# EAGLE design Pedal System Circuit (EAGLE 8.4.1)
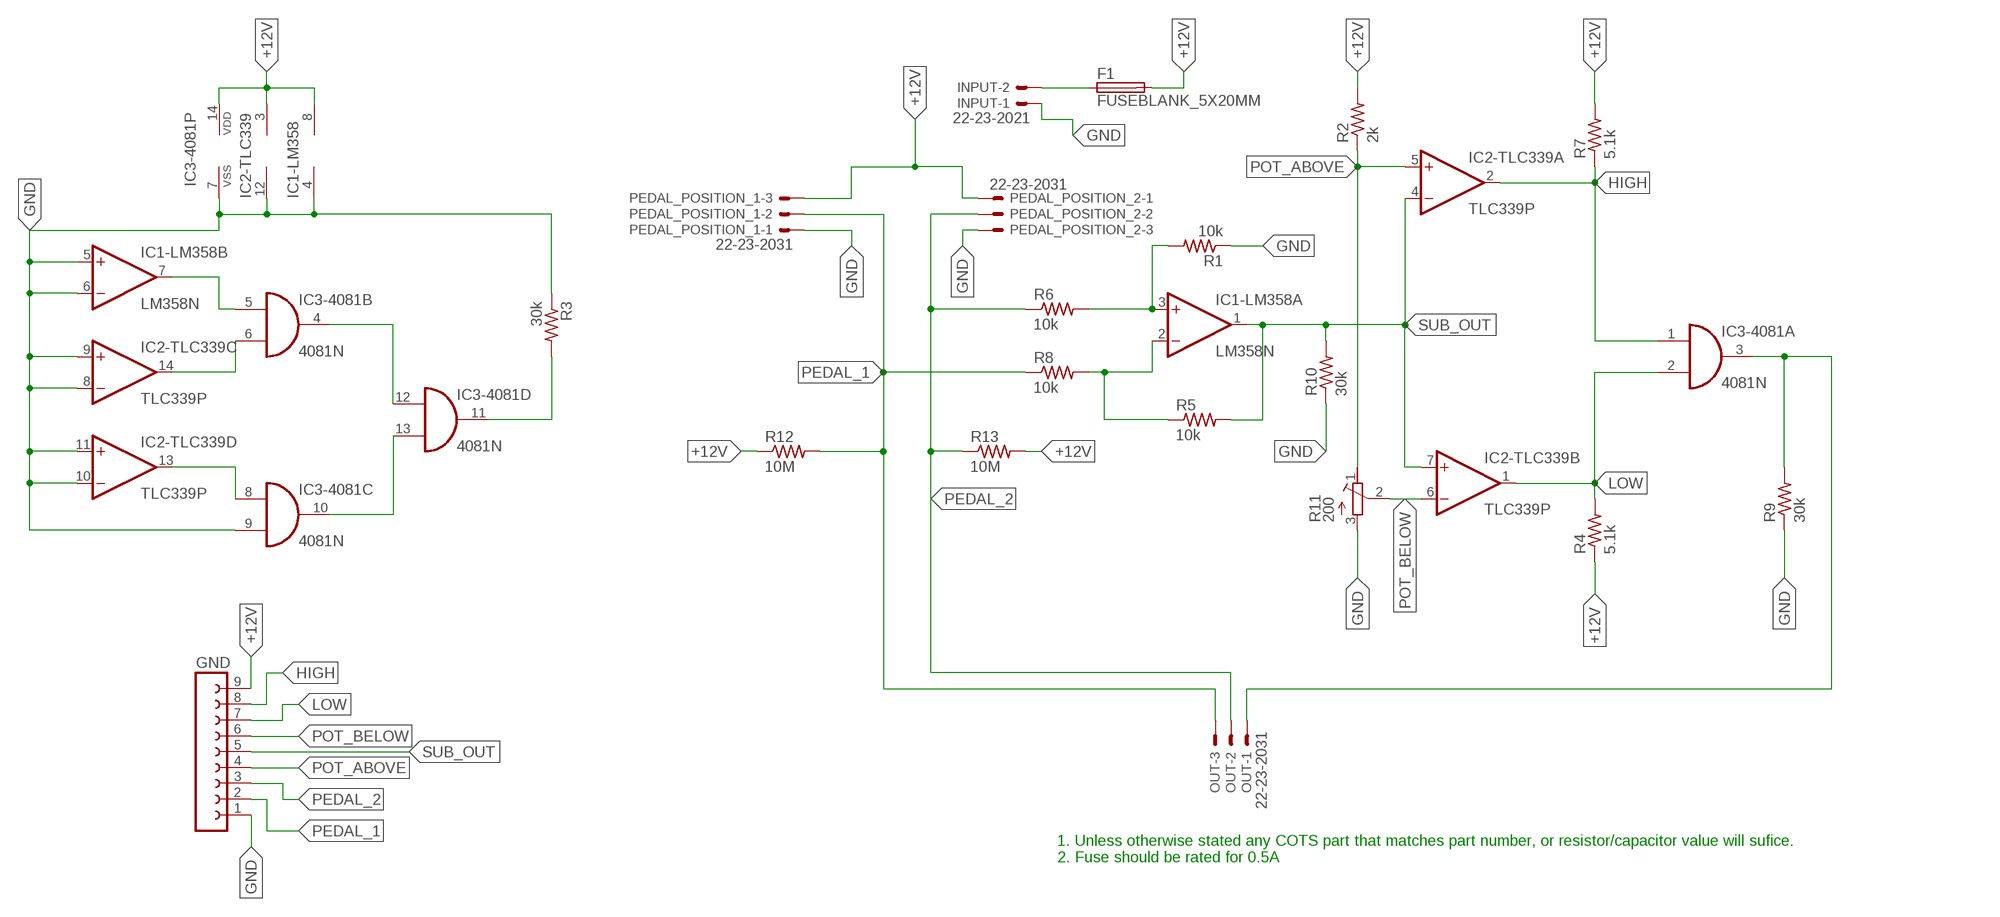
[diagram p0: schematic, sheet 1]

## Parts
F1  FUSEBLANK_5X20MM  [FUSE_HOLDER_5X20MM]
GND  FE09W  [FE09W]
IC1-LM358  LM358N  [DIL08]
IC2-TLC339  TLC339P  [DIL14]
IC3-4081  4081N  [DIL14]
INPUT  22-23-2021  [22-23-2021]
OUT  22-23-2031  [22-23-2031]
PEDAL_POSITION_1  22-23-2031  [22-23-2031]
PEDAL_POSITION_2  22-23-2031  [22-23-2031]
R1  10k  R-US_0207/12  [0207/12]
R2  2k  R-US_0309/12  [0309/12]
R3  30k  R-US_0207/12  [0207/12]
R4  5.1k  R-US_0207/12  [0207/12]
R5  10k  R-US_0207/12  [0207/12]
R6  10k  R-US_0207/12  [0207/12]
R7  5.1k  R-US_0207/12  [0207/12]
R8  10k  R-US_0207/12  [0207/12]
R9  30k  R-US_0207/12  [0207/12]
R10  30k  R-US_0207/12  [0207/12]
R11  200  R-TRIMM43P  [RTRIM43P]
R12  10M  R-US_0207/12  [0207/12]
R13  10M  R-US_0207/12  [0207/12]

## Nets
+12V: F1.2 GND.9 IC1-LM358.8(P:V+) IC2-TLC339.3(P:V+) IC3-4081.14(P:VDD) PEDAL_POSITION_1.3 PEDAL_POSITION_2.1 R2.2 R4.1 R7.2 R12.1 R13.2
GND: GND.1 IC1-LM358.4(P:V-) IC1-LM358.5(B:+IN) IC1-LM358.6(B:-IN) IC2-TLC339.8(C:-IN) IC2-TLC339.9(C:+IN) IC2-TLC339.10(D:-IN) IC2-TLC339.11(D:+IN) IC2-TLC339.12(P:V-) IC3-4081.7(P:VSS) IC3-4081.9(C:I1) INPUT.1 PEDAL_POSITION_1.1 PEDAL_POSITION_2.3 R1.1 R3.1 R9.1 R10.1 R11.3(A)
HIGH: GND.8 IC2-TLC339.2(A:OUT) IC3-4081.1(A:I0) R7.1
LOW: GND.7 IC2-TLC339.1(B:OUT) IC3-4081.2(A:I1) R4.2
N$1: IC3-4081.10(C:O) IC3-4081.13(D:I1)
N$2: IC3-4081.4(B:O) IC3-4081.12(D:I0)
N$3: IC1-LM358.3(A:+IN) R1.2 R6.2
N$4: IC3-4081.3(A:O) OUT.1 R9.2
N$5: IC3-4081.11(D:O) R3.2
N$6: IC1-LM358.7(B:OUT) IC3-4081.5(B:I0)
N$8: F1.1 INPUT.2
N$9: IC2-TLC339.13(D:OUT) IC3-4081.8(C:I0)
N$10: IC2-TLC339.14(C:OUT) IC3-4081.6(B:I1)
N$14: IC1-LM358.2(A:-IN) R5.1 R8.2
PEDAL_1: GND.2 OUT.3 PEDAL_POSITION_1.2 R8.1 R12.2
PEDAL_2: GND.3 OUT.2 PEDAL_POSITION_2.2 R6.1 R13.1
POT_ABOVE: GND.4 IC2-TLC339.5(A:+IN) R2.1 R11.1(E)
POT_BELOW: GND.6 IC2-TLC339.6(B:-IN) R11.2(S)
SUB_OUT: GND.5 IC1-LM358.1(A:OUT) IC2-TLC339.4(A:-IN) IC2-TLC339.7(B:+IN) R5.2 R10.2

## Notes on the sheet
- IC2-TLC339 | IC1-LM358
- 1. Unless otherwise stated any COTS part that matches part number, or resistor/capacitor value will sufice.
  2. Fuse should be rated for 0.5A

## Library data of the parts
F1 = fuse:FUSE: Fuse; OC_FARNELL: unknown; OC_NEWARK: unknown
GND = con-lsta:FE09W: FEMALE HEADER; OC_FARNELL: unknown; OC_NEWARK: unknown
IC1-LM358 = linear:LM358: OP AMP also LM158; LM258; LM2904 Source: http://cache.national.com/ds/LM/LM158.pdf
IC2-TLC339 = linear:TLC339: COMPARATOR
IC3-4081 = 40xx:4081: Quad 2-input AND
INPUT = con-molex:22-23-2021: .100" (2.54mm) Center Header - 2 Pin; MF: MOLEX; MPN: 22-23-2021; OC_FARNELL: 1462926; OC_NEWARK: 25C3832
OUT PEDAL_POSITION_1 PEDAL_POSITION_2 = con-molex:22-23-2031: .100" (2.54mm) Center Header - 3 Pin; MF: MOLEX; MPN: 22-23-2031; OC_FARNELL: 1462950; OC_NEWARK: 30C0862
R1-R10 R12 R13 = resistor:R-US_: RESISTOR, American symbol
R11 = resistor:R-TRIMM: Trimm resistor

## Board
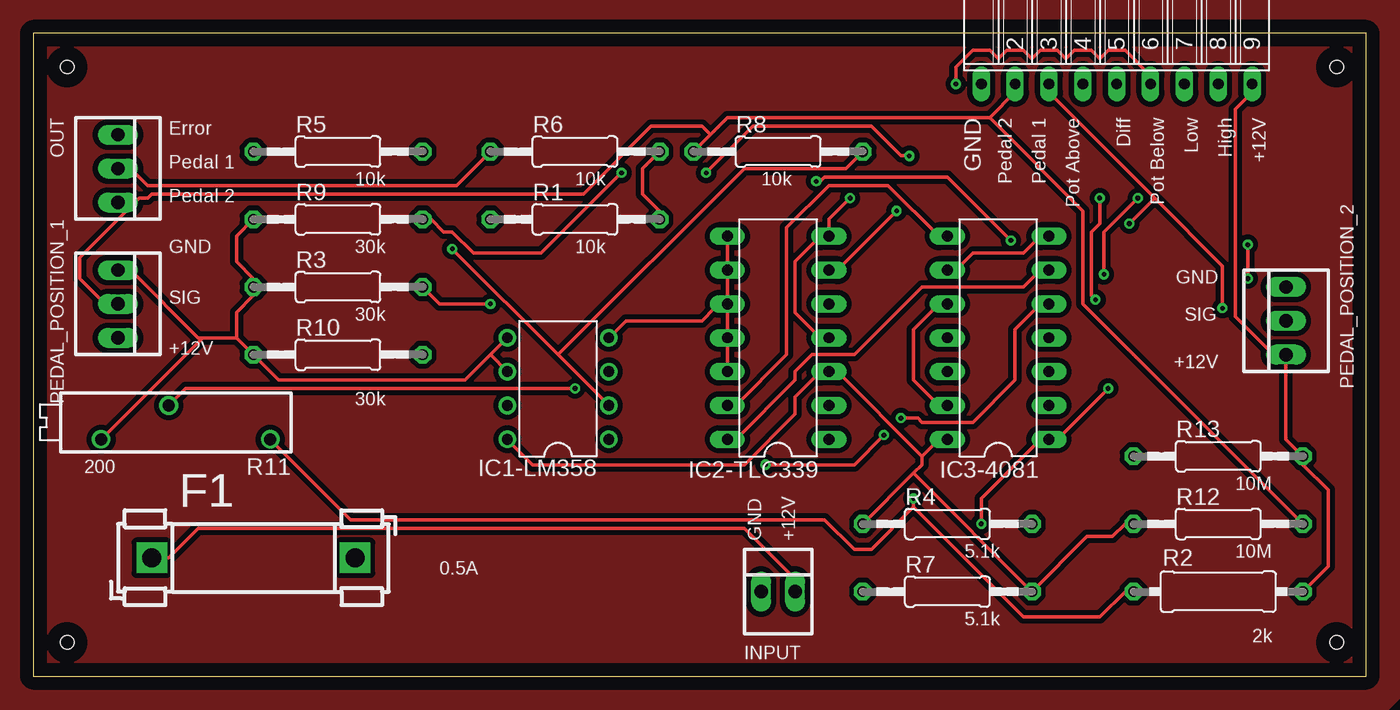
[diagram p1: board, top side]
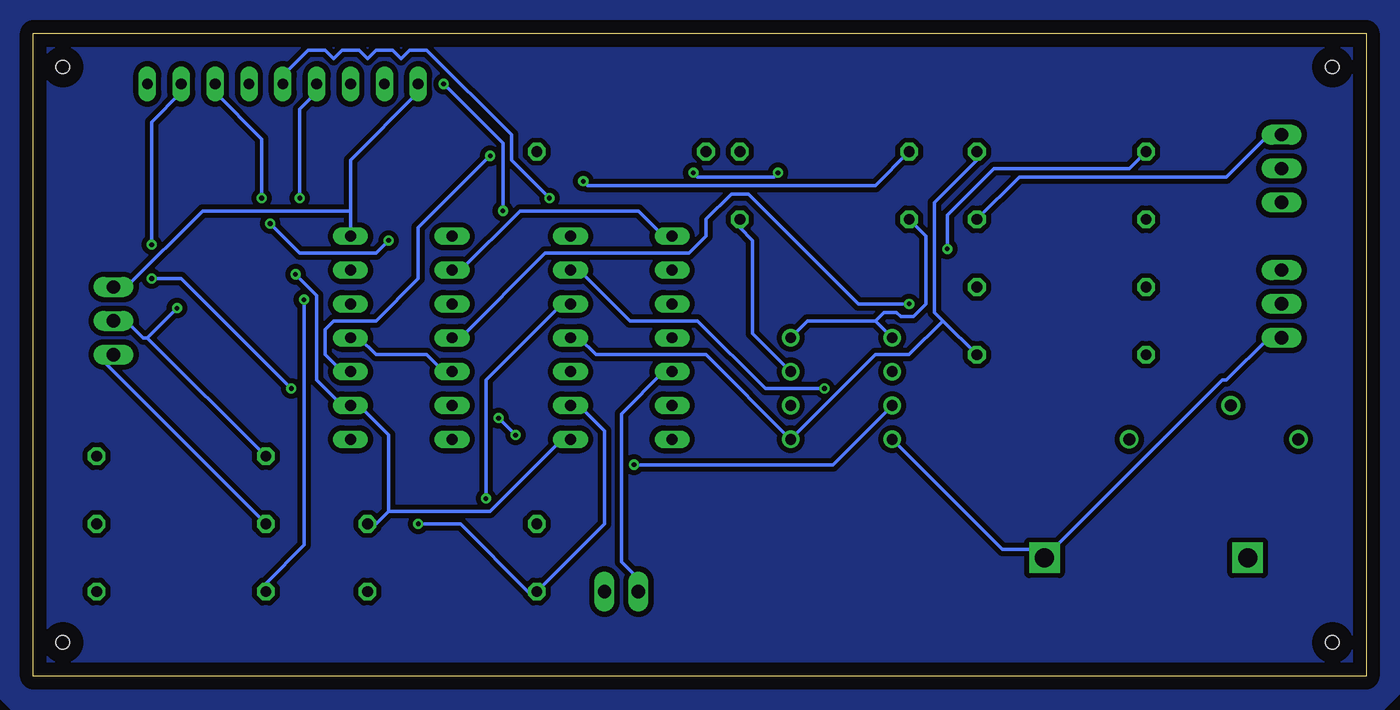
[diagram p2: board, bottom side, seen from below]

Size 100 x 48.25 mm. Coordinates in mm from the lower left corner, seen from the top.
Outline: 0,0 100,0 100,48.25 0,48.25 0,0
Copper layers (1*16): Top 0.035mm / dielectric 1.5mm / Bottom 0.035mm
Design rules "default *": minimum track width 10mil, minimum drill 0.35mm, track to track 15mil, track to pad 15mil, pad to pad 15mil, via to via 15mil, smd to smd 6mil, copper to edge 40mil, drill to drill 6mil, minimum pad ring 10mil, minimum via ring 8mil, stop-mask expansion 4mil, vias tented up to drill 0mil, thermal gap 10mil
Holes 1 mm at 2.54,45.72 97.79,45.72 2.54,2.54 97.79,2.54

### Footprints (pad centres in the part's own frame; a part is rotated, then mirrored left to right if it is on the bottom)
FUSE_HOLDER_5X20MM = drill 1.422 pad 2.286 square: 1 0,0; 2 15.24,0
FE09W = drill 0.813 long: 1 -10.16,0; 2 -7.62,0; 3 -5.08,0; 4 -2.54,0; 5 0,0; 6 2.54,0; 7 5.08,0; 8 7.62,0; 9 10.16,0
DIL08 = drill 0.813 pad 1.27: 1 -3.81,-3.81; 2 -1.27,-3.81; 3 1.27,-3.81; 4 3.81,-3.81; 5 3.81,3.81; 6 1.27,3.81; 7 -1.27,3.81; 8 -3.81,3.81
DIL14 = drill 0.813 long: 1 -7.62,-3.81; 2 -5.08,-3.81; 3 -2.54,-3.81; 4 0,-3.81; 5 2.54,-3.81; 6 5.08,-3.81; 7 7.62,-3.81; 8 7.62,3.81; 9 5.08,3.81; 10 2.54,3.81; 11 0,3.81; 12 -2.54,3.81; 13 -5.08,3.81; 14 -7.62,3.81
22-23-2021 = drill 1 long: 1 -1.27,0; 2 1.27,0
22-23-2031 = drill 1 long: 1 -2.54,0; 2 0,0; 3 2.54,0
0207/12 = drill 0.813 octagon: 1 -6.35,0; 2 6.35,0
0309/12 = drill 0.813 octagon: 1 -6.35,0; 2 6.35,0
RTRIM43P = drill 0.9: 1 -7.62,1.27; 2 0,-1.27; 3 5.08,1.27

### Placement (x,y rotation side)
F1  8.89,8.89 0 top
GND  81.28,44.45 0 top
IC1-LM358  39.37,21.59 90 top
IC2-TLC339  55.88,25.4 90 top
IC3-4081  72.39,25.4 90 top
INPUT  55.88,6.35 0 top
OUT  6.35,38.1 270 top
PEDAL_POSITION_1  6.35,27.94 270 top
PEDAL_POSITION_2  93.98,26.67 90 top
R1  40.64,34.29 0 top
R2  88.9,6.35 0 top
R3  22.86,29.21 0 top
R4  68.58,11.43 0 top
R5  22.86,39.37 0 top
R6  40.64,39.37 0 top
R7  68.58,6.35 0 top
R8  55.88,39.37 0 top
R9  22.86,34.29 0 top
R10  22.86,24.13 0 top
R11  10.16,19.05 180 top
R12  88.9,11.43 0 top
R13  88.9,16.51 0 top

### Tracks (layer width: path | path; a pad name or v marks a point on that pad's centre or on a via)
+12V
  Top 0.254: R12.1 81.92,11.43 80.96,10.48 79.06,10.48 R7.2 66.04,15.24 | 66.04,15.24 66.67,15.88 66.67,16.51 | 66.04,15.24 R4.1 | 66.67,16.51 67.94,17.78 IC3-4081.14 | 66.67,16.51 60.33,22.86 IC2-TLC339.3 59.05,22.86 57.15,20.95 57.15,19.68 53.34,15.88 37.47,15.88 IC1-LM358.8 | R2.2 97.16,8.26 97.16,13.97 95.25,15.88 R13.2 93.98,17.78 PEDAL_POSITION_2.1 93.03,24.13 90.17,26.99 90.17,42.55 91.44,43.81 GND.9
  Bottom 0.254: IC1-LM358.8 27.3,9.53 24.77,9.53 F1.2 10.79,22.23 10.48,22.23 7.3,25.4 PEDAL_POSITION_1.3 | R12.1 94.61,23.5 PEDAL_POSITION_2.1
GND
  Top 0.254: IC3-4081.9 69.22,30.48 70.48,31.75 74.3,31.75 75.56,33.02 IC3-4081.7 | 15.24,25.4 R10.1 18.41,22.23 32.38,22.23 34.29,24.13 | 15.24,25.4 15.24,27.3 16.51,28.57 R3.1 16.51,29.84 15.24,31.11 15.24,33.02 R9.1 | 12.7,25.4 R11.3 | 15.24,25.4 12.7,25.4 | PEDAL_POSITION_1.1 7.3,30.48 12.38,25.4 12.7,25.4 | 34.29,24.13 IC1-LM358.6 | IC1-LM358.5 34.29,24.13 | IC2-TLC339.8 IC2-TLC339.9 IC2-TLC339.10 52.07,27.62 | IC2-TLC339.12 IC2-TLC339.11 52.07,27.62 | IC1-LM358.4 44.45,26.67 50.16,26.67 51.12,27.62 52.07,27.62
  Bottom 0.254: GND.1 71.12,43.81 76.2,38.73 76.2,34.92 | IC3-4081.7 76.2,34.92 | PEDAL_POSITION_2.3 93.03,29.21 87.31,34.92 76.2,34.92 | IC1-LM358.4 41.91,26.67 36.83,26.67 | IC1-LM358.5 36.83,26.67 | R1.1 33.02,33.02 33.02,27.94 33.97,26.99 34.92,26.99 35.24,27.3 36.2,27.3 36.83,26.67 | INPUT.1 54.61,7.3 55.88,8.57 55.88,19.68 52.7,22.86 IC2-TLC339.12 | IC3-4081.9 67.94,30.48 63.5,34.92 54.61,34.92 52.7,33.02 IC2-TLC339.8
HIGH  (via drill 0.35)
  Top 0.254: v71.12,11.43 71.12,13.34 75.56,17.78 IC3-4081.1 76.83,17.78 v80.64,21.59 | v91.12,29.84 v91.12,32.38
  Bottom 0.254: IC2-TLC339.2 59.05,20.32 57.15,18.41 57.15,11.43 R7.1 62.87,6.35 67.94,11.43 v71.12,11.43 | GND.8 88.9,43.81 91.12,41.59 v91.12,32.38 | v91.12,29.84 88.9,29.84 v80.64,21.59
LOW  (via drill 0.35)
  Top 0.254: v82.87,35.88 80.33,33.34 v80.33,30.16
  Bottom 0.254: IC2-TLC339.1 60.33,17.78 65.72,12.38 73.34,12.38 | 73.34,12.38 74.3,11.43 R4.2 | 73.34,12.38 73.34,18.1 75.56,20.32 IC3-4081.2 76.83,20.32 78.74,22.23 78.74,28.57 v80.33,30.16 | GND.7 86.36,43.81 82.87,40.32 v82.87,35.88
N$1
  Top 0.254: IC3-4081.13 67.94,20.32 66.04,22.23 66.04,26.04 67.94,27.94 IC3-4081.10
N$2
  Bottom 0.254: IC3-4081.12 69.22,22.86 70.48,24.13 74.3,24.13 75.56,25.4 IC3-4081.4
N$3
  Top 0.254: R6.2 45.72,38.1 45.72,36.2 46.99,34.92 R1.2
  Bottom 0.254: IC1-LM358.3 46.04,25.72 46.04,32.7 46.99,33.66 R1.2
N$4  (via drill 0.35)
  Top 0.254: v65.72,39.05 65.09,39.05 62.87,41.27 53.98,41.27 v50.48,37.78 | v44.13,37.78 38.1,31.75 33.02,31.75 31.43,33.34 30.8,33.34 29.84,34.29 R9.2
  Bottom 0.254: R9.2 26.04,37.47 10.48,37.47 7.3,40.64 OUT.1 | IC3-4081.3 76.83,22.86 78.11,24.13 78.11,26.04 77.47,26.67 74.3,26.67 71.12,29.84 71.12,33.66 v65.72,39.05 | v50.48,37.78 50.16,37.47 44.45,37.47 v44.13,37.78
N$5  (via drill 0.35)
  Top 0.254: R3.2 30.48,27.94 v34.29,27.94
  Bottom 0.254: v34.29,27.94 38.1,27.94 46.35,36.2 47.62,36.2 49.53,34.29 49.53,33.02 50.8,31.75 61.59,31.75 67.94,25.4 IC3-4081.11
N$6  (via drill 0.35)
  Top 0.254: v54.93,15.88 61.59,15.88 v63.82,18.1 | v65.09,19.37 66.36,19.37 66.67,19.05 70.48,19.05 73.66,22.23 73.66,26.04 75.56,27.94 IC3-4081.5
  Bottom 0.254: IC1-LM358.7 40.01,15.88 v54.93,15.88 | v65.09,19.37 v63.82,18.1
N$7
  pour Top: -3.81,50.8 -3.81,-3.81 100.33,-3.81 105.41,1.27 105.41,53.34 104.14,54.61 0,54.61
N$8
  Top 0.254: INPUT.2 57.15,7.3 53.34,11.11 12.38,11.11 10.16,8.89 F1.1
N$9
  Top 0.254: IC2-TLC339.13 52.7,20.32 56.52,24.13 56.52,33.66 59.69,36.83 64.14,36.83 67.94,33.02 IC3-4081.8
N$10
  Top 0.254: IC2-TLC339.14 52.7,17.78 57.15,22.23 57.15,22.86 58.42,24.13 61.59,24.13 66.67,29.21 74.3,29.21 75.56,30.48 IC3-4081.6
N$11
  pour Bottom: 2.54,55.88 -3.81,49.53 -3.81,0 0,-3.81 100.33,-3.81 101.6,-2.54 105.41,1.27 105.41,53.34 104.14,54.61 102.87,55.88
N$14  (via drill 0.35)
  Top 0.254: IC1-LM358.2 39.37,24.13 | 39.37,24.13 v31.43,32.07 | R8.2 60.96,38.1 53.34,38.1 39.37,24.13
  Bottom 0.254: R5.1 17.78,38.1 27.94,38.1 31.43,34.61 v31.43,32.07
PEDAL_1
  Top 0.254: PEDAL_POSITION_1.2 5.4,27.94 3.49,29.84 3.49,31.43 6.99,34.92 | 50.8,40.64 52.07,41.91 71.75,41.91 | 50.8,40.64 R8.1 | 71.75,41.91 73.66,43.81 GND.2 | R12.2 78.74,27.94 78.74,34.92 71.75,41.91 | 6.99,34.92 7.94,35.88 8.57,35.88 8.89,36.2 41.27,36.2 46.35,41.27 50.16,41.27 50.8,40.64 | 6.99,34.92 OUT.3
PEDAL_2  (via drill 0.35)
  Top 0.254: R6.1 31.75,36.83 8.57,36.83 7.3,38.1 OUT.2 | GND.3 76.2,43.81 84.14,35.88 | 84.14,35.88 89.22,30.8 v89.22,27.62 | v58.74,37.15 59.05,37.15 59.37,37.47 68.58,37.47 v73.34,32.7 | 84.14,35.88 v82.23,33.97
  Bottom 0.152: 76.2,44.35 GND.3
  Bottom 0.254: 91.44,25.4 R13.1 | 91.44,25.4 91.76,25.4 93.03,26.67 PEDAL_POSITION_2.2 | 91.44,25.4 v89.22,27.62 | R6.1 36.83,36.83 58.42,36.83 v58.74,37.15 | v73.34,32.7 74.3,31.75 80.01,31.75 v82.23,33.97
POT_ABOVE  (via drill 0.35)
  Top 0.254: 66.04,12.7 v66.04,13.34 | 66.04,12.7 74.3,4.45 80.01,4.45 81.92,6.35 R2.1 | v80.01,35.88 80.01,33.97 79.38,33.34 79.38,28.57 v79.69,28.26 | R11.1 23.81,11.75 59.37,11.75 61.59,9.53 62.87,9.53 66.04,12.7
  Bottom 0.254: IC2-TLC339.5 60.33,27.94 66.04,22.23 v66.04,13.34 | GND.4 78.74,43.81 80.01,42.55 v80.01,35.88 | v79.69,28.26 79.69,9.84 82.55,6.99 R2.1
POT_BELOW  (via drill 0.35)
  Top 0.254: IC2-TLC339.6 60.33,30.48 v64.77,34.92 | v69.22,44.45 69.22,45.72 70.48,46.99 71.75,46.99 72.39,46.35 73.03,46.99 74.3,46.99 74.93,46.35 75.56,46.99 76.83,46.99 77.47,46.35 78.11,46.99 79.38,46.99 80.01,46.35 80.64,46.99 81.92,46.99 83.82,45.09 GND.6 | R11.2 11.43,21.59 v40.64,21.59
  Bottom 0.254: v64.77,34.92 64.77,40.01 v69.22,44.45 | v40.64,21.59 45.09,21.59 50.16,26.67 55.24,26.67 59.05,30.48 IC2-TLC339.6
SUB_OUT  (via drill 0.35)
  Top 0.254: IC2-TLC339.4 59.05,25.4 57.15,27.3 57.15,31.11 59.05,33.02 IC2-TLC339.7 59.69,34.29 v61.28,35.88
  Bottom 0.254: 31.75,26.67 32.38,27.3 32.38,35.56 29.21,38.73 R5.2 | 31.75,26.67 R10.2 | 31.75,26.67 34.29,24.13 36.83,24.13 IC1-LM358.1 49.53,24.13 57.78,24.13 59.05,25.4 IC2-TLC339.4 | GND.5 81.28,45.09 79.38,46.99 78.11,46.99 77.47,46.35 76.83,46.99 75.56,46.99 74.93,46.35 74.3,46.99 73.03,46.99 72.39,46.35 71.75,46.99 70.48,46.99 64.14,40.64 64.14,38.73 v61.28,35.88

### Text on the board
tNames: Pedal 2 | Pedal 1 | Pot Above | Diff | Pot Below | Low | High | +12V | Error | Pedal 1 | 10k | 10k | 10k | Pedal 2 | GND | 30k | 10k | GND | SIG | 30k | SIG | +12V | +12V | 30k | 200 | 10M | GND | +12V | 5.1k | 10M | 0.5A | 5.1k | 2k